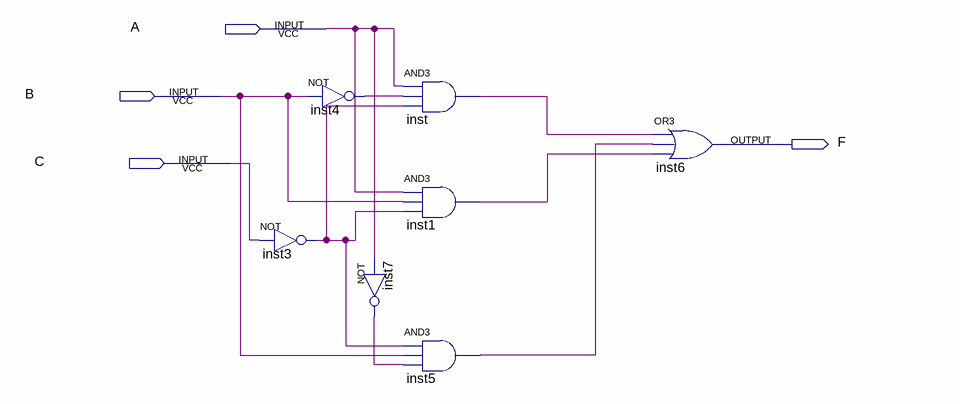
[diagram p0: schematic sheet]
// Quartus schematic lab2step1.bdf as structural Verilog: 7 symbols, 4 pins
module lab2step1 (
  input  A,
  input  B,
  input  C,
  output F
);

  wire inst1_out, inst3_out, inst4_out, inst5_out, inst7_out, inst_out;

  not inst3 (inst3_out, C);
  not inst4 (inst4_out, B);
  not inst7 (inst7_out, A);
  and inst (inst_out, A, inst4_out, inst3_out);
  and inst1 (inst1_out, A, B, inst3_out);
  and inst5 (inst5_out, inst3_out, B, inst7_out);
  or inst6 (F, inst_out, inst5_out, inst1_out);
endmodule
